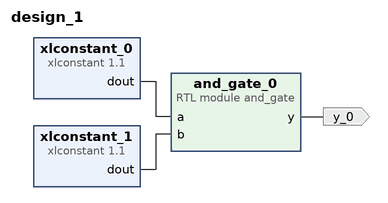
[diagram p0: block diagram of the top level]
# Vivado block design design_1, xc7a35tftg256-1, Vivado 2024.2
create_bd_design design_1

create_bd_port -dir O y_0

create_bd_cell -type module -reference and_gate and_gate_0
create_bd_cell -type ip -vlnv xilinx.com:ip:xlconstant:1.1 xlconstant_0
create_bd_cell -type ip -vlnv xilinx.com:ip:xlconstant:1.1 xlconstant_1
set_property -dict {CONFIG.CONST_VAL 1} [get_bd_cells xlconstant_1]

# ---- connections ----

connect_bd_net [get_bd_pins and_gate_0/y] [get_bd_ports y_0]
connect_bd_net [get_bd_pins xlconstant_0/dout] [get_bd_pins and_gate_0/a]
connect_bd_net [get_bd_pins xlconstant_1/dout] [get_bd_pins and_gate_0/b]

validate_bd_design
save_bd_design
